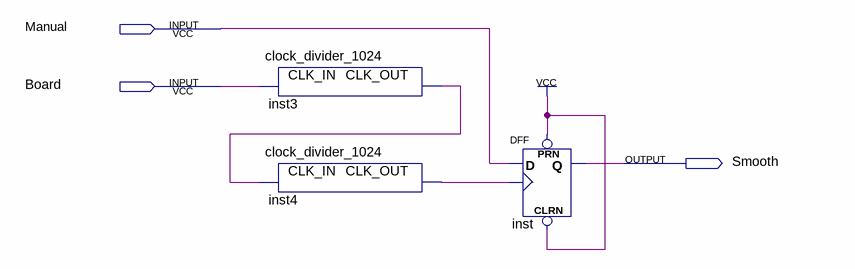
[diagram p0: schematic sheet]
// Quartus schematic Debouncer.bdf as structural Verilog: 3 symbols, 3 pins
module Debouncer (
  input  Manual,
  input  Board,
  output Smooth
);

  wire inst3_clk_out, inst4_clk_out;

  clock_divider_1024 inst3 (.CLK_IN(Board), .CLK_OUT(inst3_clk_out));
  clock_divider_1024 inst4 (.CLK_IN(inst3_clk_out), .CLK_OUT(inst4_clk_out));
  DFF inst (.CLRN(1'b1), .CLK(inst4_clk_out), .D(Manual), .PRN(1'b1), .Q(Smooth));
endmodule
